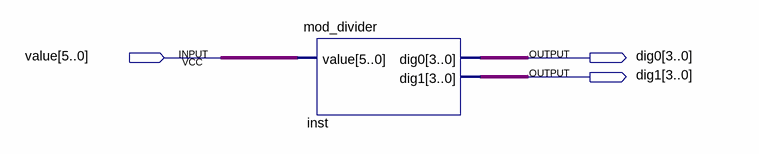
[diagram p0: schematic sheet]
// Quartus schematic divider.bdf as structural Verilog: 1 symbols, 3 pins
module divider (
  input  [5:0] value,
  output [3:0] dig0,
  output [3:0] dig1
);

  mod_divider inst (.value(value), .dig0(dig0), .dig1(dig1));
endmodule
